# EAGLE design SparkFun_MMA8452Q-Breakout (EAGLE 7.3.0)
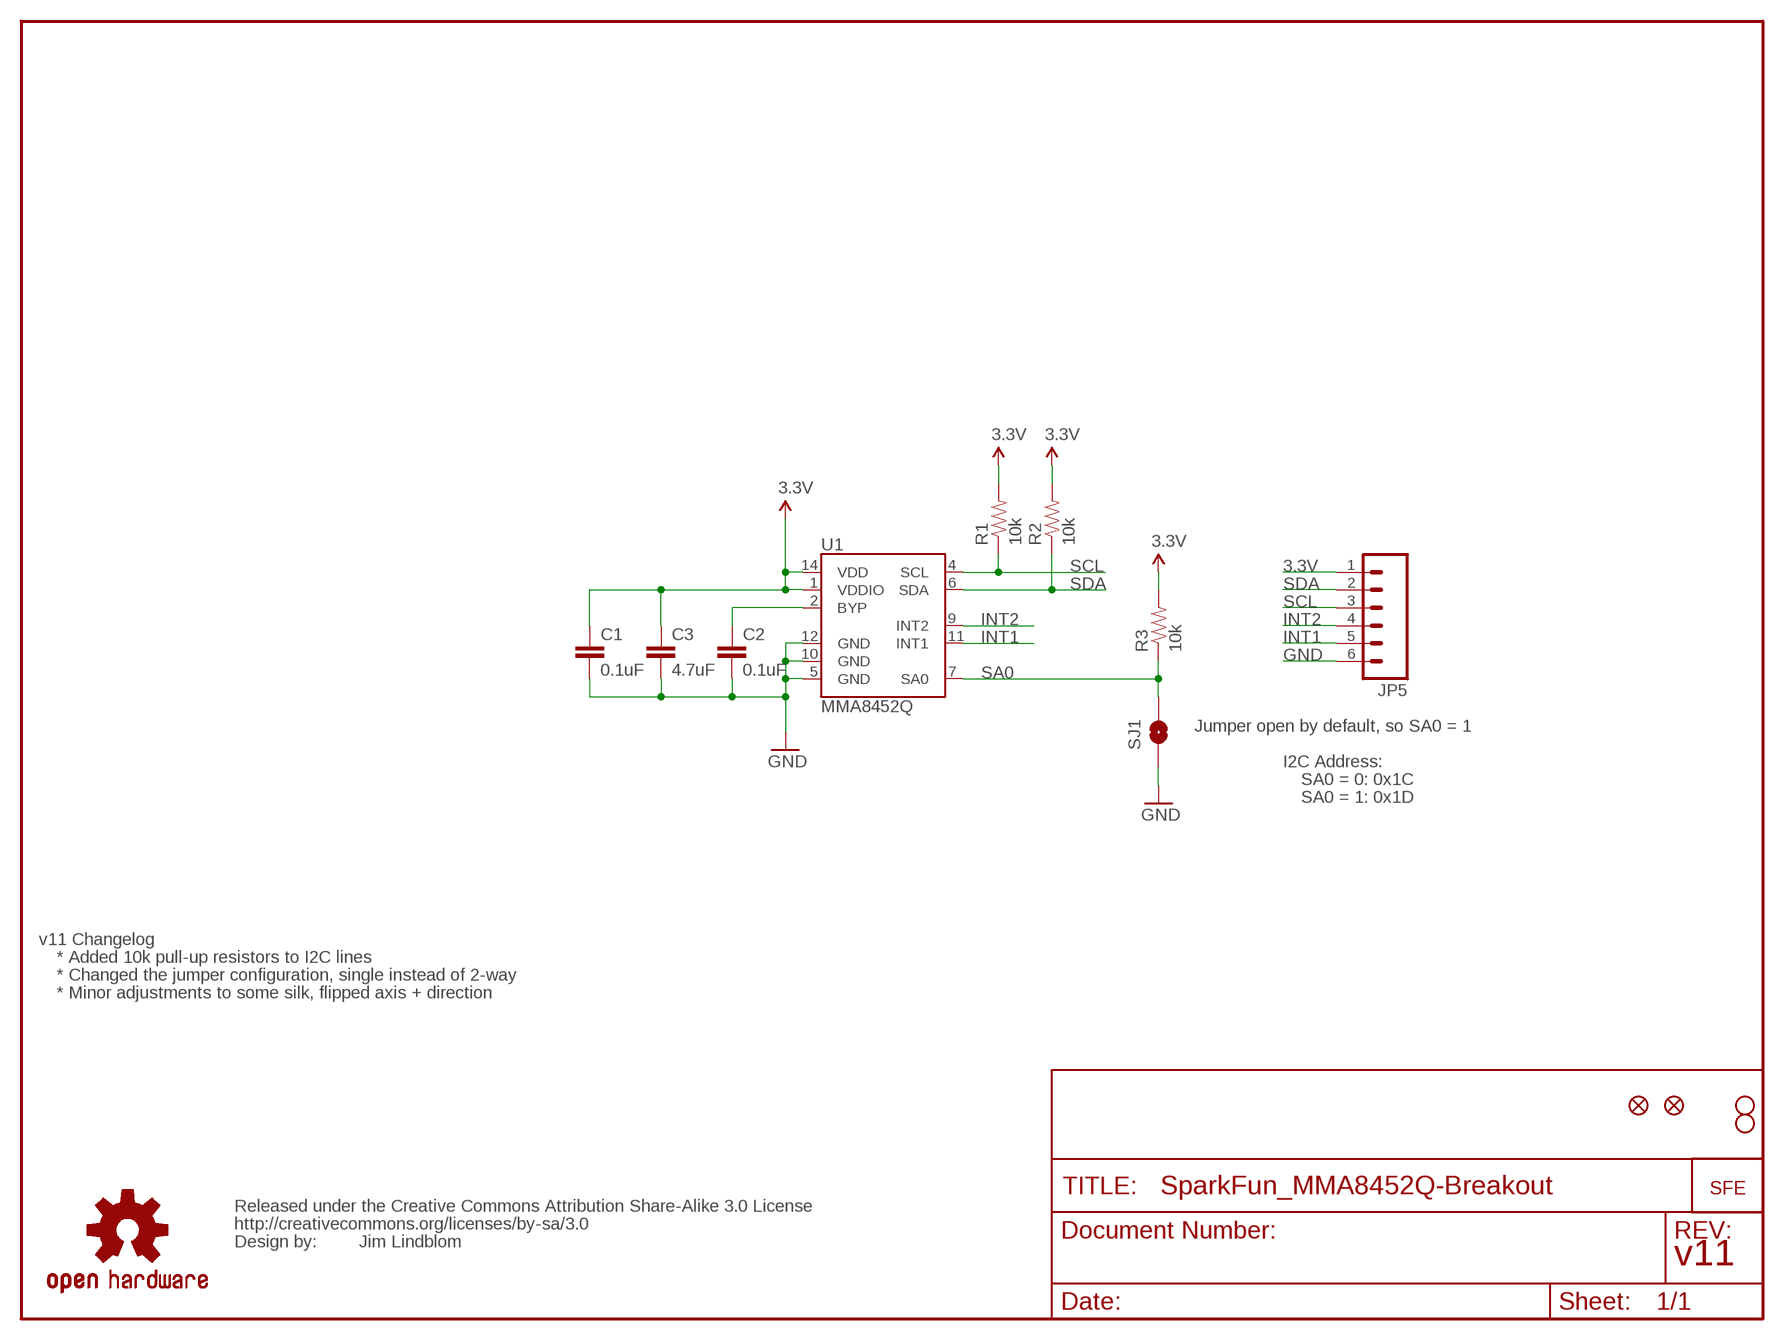
[diagram p0: schematic, sheet 1]

## Parts
C1  0.1uF  CAP0402-CAP  [0402-CAP]
C2  0.1uF  CAP0402-CAP  [0402-CAP]
C3  4.7uF  CAP0402-CAP  [0402-CAP]
JP1  LOGO-SFESK  [SFE-LOGO-FLAME]
JP2  FIDUCIALUFIDUCIAL  [MICRO-FIDUCIAL]
JP3  STAND-OFF  [STAND-OFF]
JP4  STAND-OFF  [STAND-OFF]
JP5  M06SIP  [1X06]
JP6  FIDUCIALUFIDUCIAL  [MICRO-FIDUCIAL]
R1  10k  RESISTOR0402-RES  [0402-RES]
R2  10k  RESISTOR0402-RES  [0402-RES]
R3  10k  RESISTOR0402-RES  [0402-RES]
SJ1  SOLDERJUMPERNO  [SJ_2S-NO]
U1  MMA8452Q  [QFN-16_0.5MM]
U$1  OSHW-LOGOS  [OSHW-LOGO-S]
U$2  CREATIVE_COMMONS  [CREATIVE_COMMONS]

## Nets
3.3V: C1.1 C3.1 JP5.1 R1.2 R2.2 R3.2 U1.1(VDDIO) U1.14(VDD)
BYP: C2.1 U1.2(BYP)
GND: C1.2 C2.2 C3.2 JP5.6 SJ1.1 U1.5(GND) U1.10(GND) U1.12(GND)
INT1: JP5.5 U1.11(INT1)
INT2: JP5.4 U1.9(INT2)
SA0: R3.1 SJ1.2 U1.7(SA0)
SCL: JP5.3 R1.1 U1.4(SCL)
SDA: JP5.2 R2.1 U1.6(SDA)

## Notes on the sheet
- Jumper open by default, so SA0 = 1
- I2C Address:
- SA0 = 0: 0x1C
- SA0 = 1: 0x1D
- v11 Changelog
- * Added 10k pull-up resistors to I2C lines
- * Changed the jumper configuration, single instead of 2-way
- * Minor adjustments to some silk, flipped axis + direction
- Jim Lindblom
- v11

## Library data of the parts
C1-C3 = SparkFun:CAP: Capacitor Standard 0603 ceramic capacitor, and 0.1" leaded capacitor.
JP1 = SparkFun:LOGO-SFE: Spark Fun Electronics PCB Logo This is the standard Spark Fun Electronics PCB logo.
JP2 JP6 = SparkFun:FIDUCIAL: Fiducial Alignment Points Various fiducial points for machine vision alignment.
JP3 JP4 = SparkFun:STAND-OFF: Stand Off This is the mechanical footprint for a #4 phillips button head screw. Use the keepout ring to avoid running the screw head into surrounding components. SKU : PRT-00447
JP5 = SparkFun:M06: Header 6 Standard 6-pin 0.1" header. Use with straight break away headers (SKU : PRT-00116), right angle break away headers (PRT-00553), swiss pins (PRT-00743), machine pins (PRT-00117), and female headers (PRT-00115). Molex polarized connector foot print use with SKU : PRT-08094 with associated crimp pins and housings. NOTES ON THE VARIANTS LOCK and LOCK_LONGPADS... This footprint was designed to help hold the alignment of a through-hole component (i.e. 6-pin header) while soldering it into place. You may notice that each hole has been shifted either up or down by 0.005 of an inch from it's more standard position (which is a perfectly straight line). This slight alteration caused the pins (the squares in the middle) to touch the edges of the holes. Because they are alternating, it causes a "brace" to hold the component in place. 0.005 has proven to be the perfect amount of "off-center" position when using our standard breakaway headers. Although looks a little odd when you look at the bare footprint, once you have a header in there, the alteration is very hard to notice. Also, if you push a header all the way into place, it is covered up entirely on the bottom side. This idea of altering the position of holes to aid alignment will be further integrated into the Sparkfun Library for other footprints. It can help hold any component with 3 or more connection pins.
R1-R3 = SparkFun:RESISTOR: Resistor Basic schematic elements and footprints for 0603, 1206, and PTH resistors.
SJ1 = SparkFun:SOLDERJUMPER: Solder Jumper Standard SMD solder jumper. Used to automate production. Two varients : Normally Open and Normally Closed are the same, but have different paste layers. NC will have a large amount of paste and should jumper during reflow.
U1 = SparkFun:MMA8452Q: MMA8452Q 3-Axis, 12/8-bit Digital Accelerometer Supply Voltage: 1.6-3.6V Range: +/- 2g, 4g, 8g Interface: I2C, 12-bit and 8-bit ODR: 1.56 Hz - 800 Hz Package: QFN-16 http://cache.freescale.com/files/sensors/doc/data_sheet/MMA8452Q.pdf
U$1 = SparkFun:OSHW-LOGO: Open Source Hardware Logo This logo indicates the piece of hardware it is found on incorporates a OSHW license and/or adheres to the definition of open source hardware found here: http://freedomdefined.org/OSHW
U$2 = SparkFun:CREATIVE_COMMONS

## Board
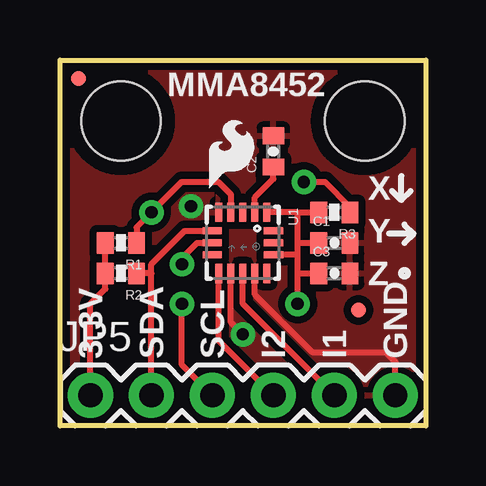
[diagram p1: board, top side]
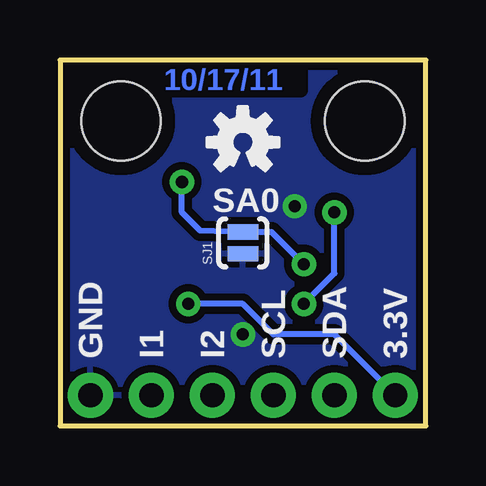
[diagram p2: board, bottom side, seen from below]

Size 15.24 x 15.24 mm. Coordinates in mm from the lower left corner, seen from the top.
Outline: 0,0 0,15.24 15.24,15.24 15.24,0 0,0
Copper layers (1*16): Top 0.035mm / dielectric 1.5mm / Bottom 0.035mm
Design rules "SparkFun": minimum track width 8mil, minimum drill 20mil, track to track 8mil, track to pad 8mil, pad to pad 8mil, via to via 8mil, smd to smd 8mil, copper to edge 8mil, drill to drill 8mil, minimum pad ring 12mil, minimum via ring 10mil, stop-mask expansion 4mil, vias tented up to drill 20mil, thermal gap 10mil

### Footprints (pad centres in the part's own frame; a part is rotated, then mirrored left to right if it is on the bottom)
0402-CAP = smd 0.7 x 0.9: 1 -0.65,0; 2 0.65,0
MICRO-FIDUCIAL = smd 0.635 x 0.635: 1 0,0
STAND-OFF = hole 3.302: 0,0
1X06 = drill 1.016 pad 1.88 round: 1 0,0; 2 2.54,0; 3 5.08,0; 4 7.62,0; 5 10.16,0; 6 12.7,0
0402-RES = smd 0.7 x 0.9: 1 -0.65,0; 2 0.65,0
SJ_2S-NO = smd 0.635 x 1.27: 1 -0.45,0; 2 0.45,0
QFN-16_0.5MM = smd 0.8 x 0.3: 1 -1.275,1; 2 -1.275,0.5; 3 -1.275,0; 4 -1.275,-0.5; 5 -1.275,-1; 9 1.275,-1; 10 1.275,-0.5; 11 1.275,0; 12 1.275,0.5; 13 1.275,1 | smd 0.3 x 0.8: 6 -0.5,-1.275; 7 0,-1.275; 8 0.5,-1.275; 14 0.5,1.275; 15 0,1.275; 16 -0.5,1.275

### Placement (x,y rotation side)
C1  11.43,7.62 0 top
C2  8.89,11.43 90 top
C3  11.43,6.35 0 top
JP1  6.22,9.91 0 top
JP2  12.45,4.83 0 top
JP3  2.54,12.7 0 top
JP4  12.7,12.7 0 top
JP5  1.27,1.27 0 top
JP6  0.76,14.48 0 top
R1  2.54,7.62 180 top
R2  2.54,6.35 180 top
R3  11.43,8.89 180 top
SJ1  7.62,7.62 90 bottom
U1  7.62,7.62 270 top
U$1  7.62,11.81 0 bottom
U$2  -15.24,-6.35 0 top  (outside the outline)

### Tracks (layer width: path | path; a pad name or v marks a point on that pad's centre or on a via)
3.3V  (via drill 0.51)
  Top 0.254: R1.2 R2.2 1.89,5.7 1.27,5.08 JP5.1 | 9.9,7.12 U1.14 | v9.9,5.08 9.9,6.35 | 9.9,6.35 9.9,7.12 | 9.91,8.89 U1.1 | 9.91,8.89 R3.2 | 9.9,7.12 9.9,7.62 | 9.9,7.62 9.9,8.89 9.91,8.89 | 9.9,7.62 C1.1 | 9.9,6.35 C3.1
  Bottom 0.254: v9.9,5.08 7.62,5.08 6.35,3.81 3.81,3.81 JP5.1
BYP
  Top 0.254: U1.2 8.12,9.52 8.89,10.29 C2.1
GND  (via drill 0.51)
  Top 0.254: U1.10 7.12,4.31 v7.62,3.81 | U1.12 8.12,5.47 10.54,3.05 13.59,3.05 13.97,2.67 JP5.6
  other vias: 5.46,9.14
  pour Bottom (isolate 0.305): 0,0 0,15.24 15.24,15.24 15.24,0
  pour Top (isolate 0.305): 0,0 0,15.24 15.24,15.24 15.24,0
INT1
  Top 0.254: U1.11 7.62,5.08 JP5.5
INT2
  Top 0.254: U1.9 6.62,3.54 JP5.4
SA0  (via drill 0.51)
  Top 0.254: U1.7 5.71,7.62 5.08,6.99 v5.08,6.73 | R3.1 12.08,9.13 11.05,10.16 v10.16,10.16
  Bottom 0.254: 5.21,6.86 v5.08,6.73 6.42,8.07 SJ1.2 9.4,8.13 10.16,8.89 v10.16,10.16
SCL  (via drill 0.51)
  Top 0.254: U1.4 7.12,9.64 6.6,10.16 5.08,10.16 v3.81,8.89 3.19,8.27 R1.1 | v5.08,5.08 5.08,2.54 JP5.3
  Bottom 0.254: v3.81,8.89 3.81,6.35 v5.08,5.08
SDA
  Top 0.254: 3.81,6.35 R2.1 | JP5.2 3.81,6.35 | U1.6 5.2,8.12 3.81,6.73 3.81,6.35

### Text on the board
Bottom: 10/17/11
tPlace: MMA8452 | X | Y | Z | 3.3V | SDA | SCL | I2 | I1 | GND
bPlace: SA0 | 3.3V | SDA | SCL | I2 | I1 | GND